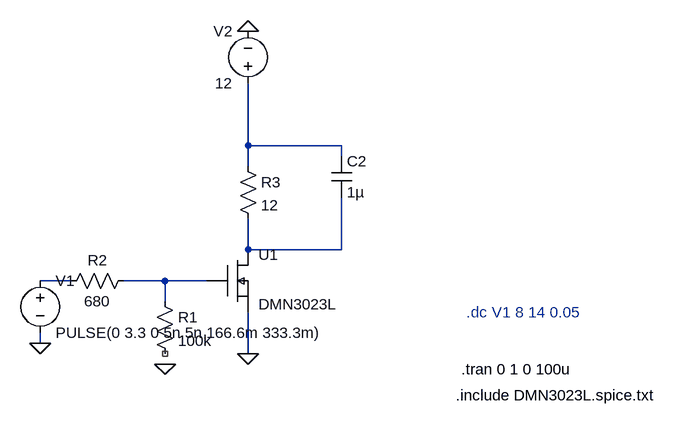
[diagram p0: schematic SimulacionASSIs.asc]
SimulacionASSIs.asc, the LTspice schematic file:
Version 4
SHEET 1 1328 680
WIRE 400 224 400 128
WIRE 544 224 400 224
WIRE 544 240 544 224
WIRE 400 256 400 224
WIRE 400 384 400 336
WIRE 544 384 544 304
WIRE 544 384 400 384
WIRE 128 432 80 432
WIRE 272 432 208 432
WIRE 336 432 272 432
WIRE 272 464 272 432
WIRE 80 528 80 512
WIRE 400 544 400 480
FLAG 80 528 0
FLAG 400 544 0
FLAG 400 48 0
FLAG 272 560 0
SYMBOL res 256 448 R0
SYMATTR InstName R1
SYMATTR Value 100k
SYMBOL Res 112 448 R270
WINDOW 0 32 56 VTop 2
WINDOW 3 0 56 VBottom 2
SYMATTR InstName R2
SYMATTR Value 680
SYMBOL DMN3023L 336 368 R0
SYMATTR InstName U1
SYMBOL voltage 80 416 R0
SYMATTR InstName V1
SYMATTR Value PULSE(0 3.3 0 5n 5n 166.6m 333.3m)
SYMBOL voltage 400 144 R180
WINDOW 0 24 96 Left 2
WINDOW 3 24 16 Left 2
SYMATTR InstName V2
SYMATTR Value 12
SYMBOL cap 528 240 R0
SYMATTR InstName C2
SYMATTR Value 1µ
SYMBOL res 384 240 R0
SYMATTR InstName R3
SYMATTR Value 12
TEXT 720 608 Left 2 !.include DMN3023L.spice.txt
TEXT 728 568 Left 2 !.tran 0 1 0 100u
TEXT 736 480 Left 2 ;.dc V1 8 14 0.05

The netlist it stands for:
* SimulacionASSIs.asc
R1 N004 NC_01 100k
R2 N003 N004 680
XU1 N002 N004 0 DMN3023L  ; pins D G S
V1 N003 0 PULSE(0 3.3 0 5n 5n 166.6m 333.3m)
V2 N001 0 12
C2 N001 N002 1µ
R3 N001 N002 12
.include DMN3023L.spice.txt
.tran 0 1 0 100u
* .dc V1 8 14 0.05
.lib DMN3023L.spice.txt
.backanno
.end